# Altium project WaterDispenser.PrjPcb
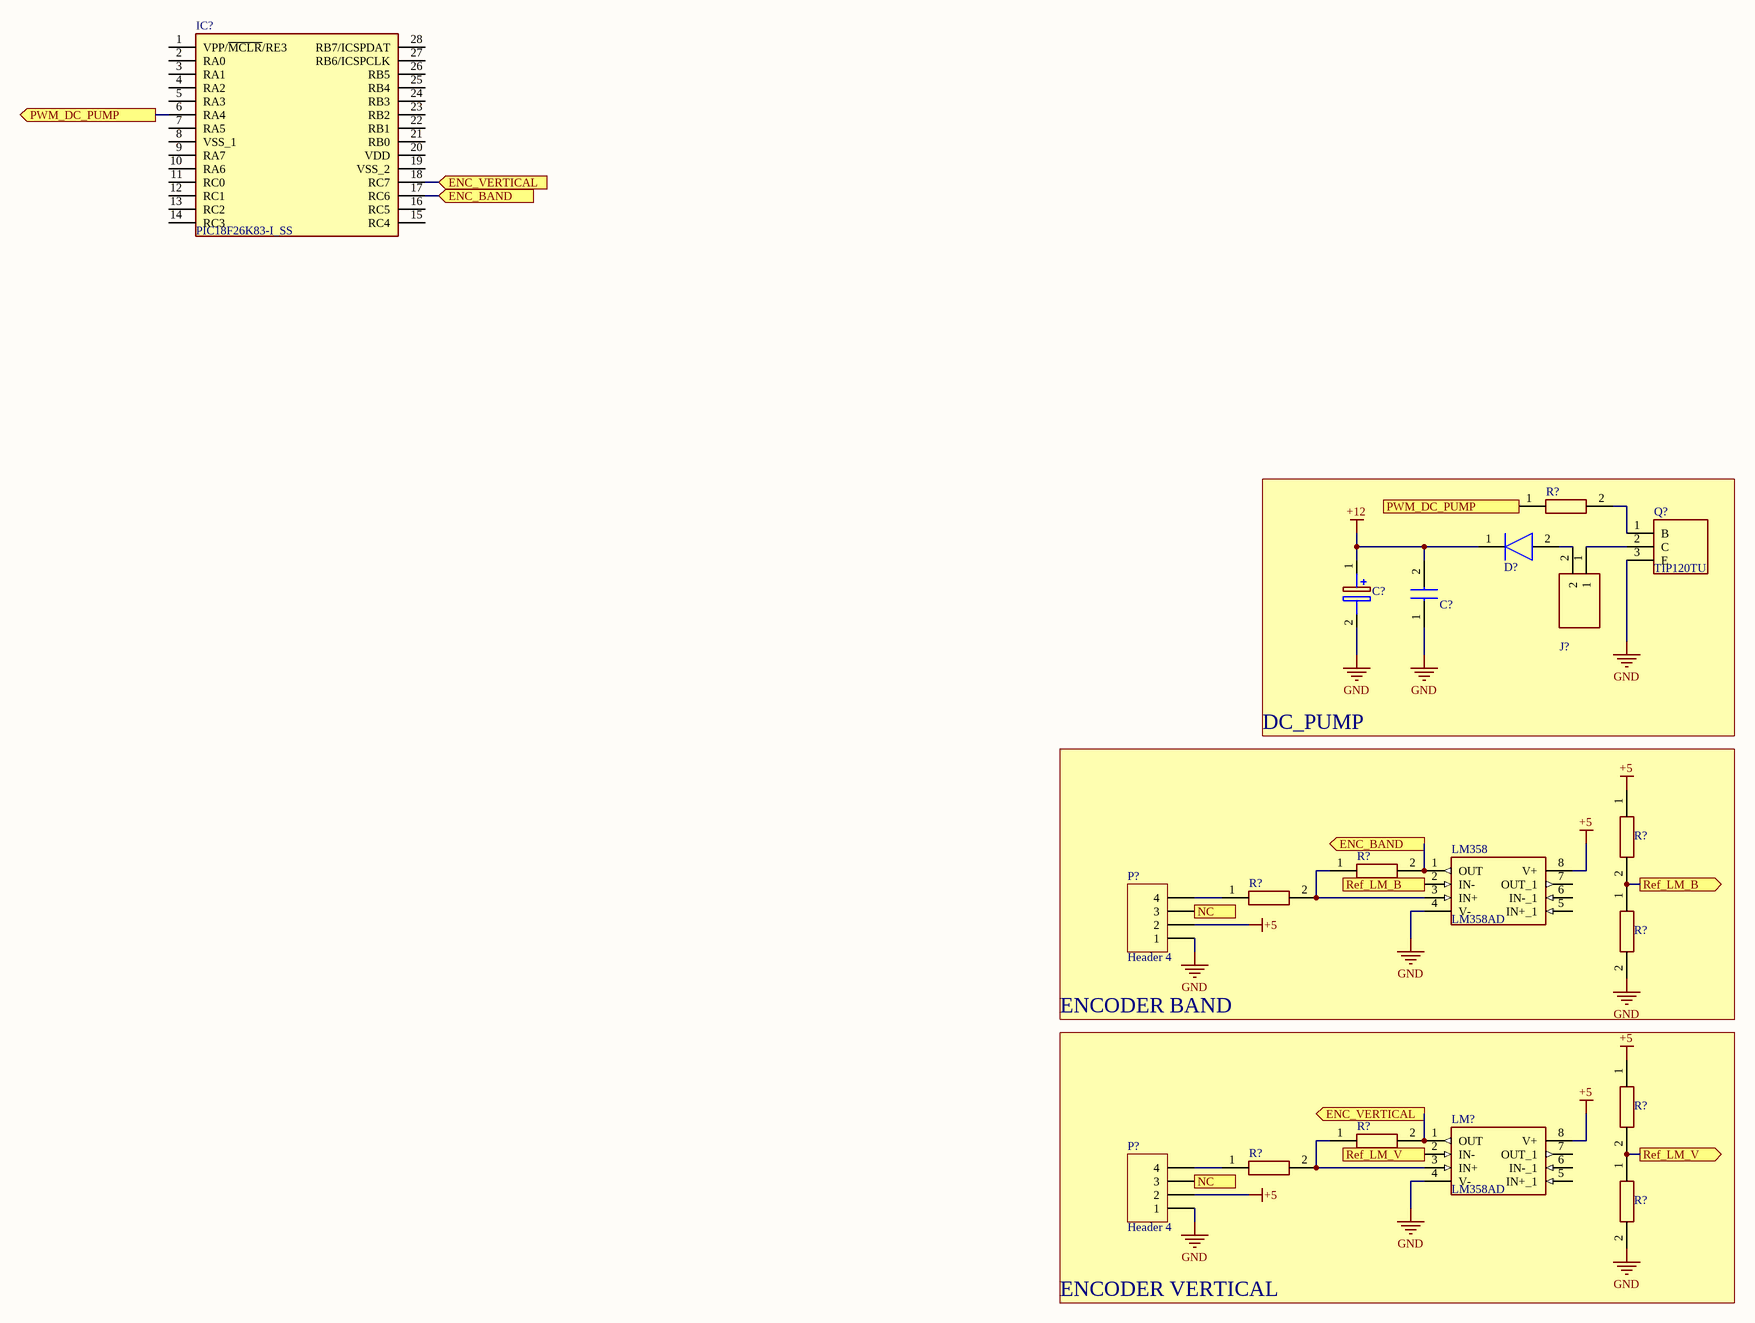
[diagram p0: Sch_WaterDispenser.SchDoc]
1 sheet, 19 parts. Net scope: flat (ports and power ports of the same name join across sheets).

## Sheet Sch_WaterDispenser.SchDoc
size A2; Organization: Altium Limited; Address1: L3, 12a Rodborough Rd; Address2: Frenchs Forest; Address3: NSW; Address4: Australia 2086

### Parts
(Parts that share a designator on the sheet are numbered #1, #2 ... from top to bottom, then left to right.)
C?#1  EEE-HAC221XAP  [CAPAE660X800N]  (value not drawn)
C?#2  GRM2165C1H471JA01J  [CAPC2012X70N]  (value not drawn)
D?  1SR154-400TE25  [DIOM5026X220N]  (value not drawn)
IC?  PIC18F26K83-I_SS  [SOP65P780X200-28N]
J?  TB002-500-02BE  [SHDR2W100P0X500_1X2_1000X760X1040P]  (value not drawn)
LM358  LM358AD  [SOIC127P600X175-8N]
LM?  LM358AD  [SOIC127P600X175-8N]
P?#1  Header 4  [HDR1X4]
P?#2  Header 4  [HDR1X4]
Q?  TIP120TU  [TO254P470X1016X2167-3P]
R?#1  ERJ-6RBD7502V  [RESC2012X70N]  (value not drawn)
R?#2  ERJ-6RBD7502V  [RESC2012X70N]  (value not drawn)
R?#3  ERJ-6RBD7502V  [RESC2012X70N]  (value not drawn)
R?#4  ERJ-6RBD7502V  [RESC2012X70N]  (value not drawn)
R?#5  ERJ-6RBD7502V  [RESC2012X70N]  (value not drawn)
R?#6  ERJ-6RBD7502V  [RESC2012X70N]  (value not drawn)
R?#7  ERJ-6RBD7502V  [RESC2012X70N]  (value not drawn)
R?#8  ERJ-6RBD7502V  [RESC2012X70N]  (value not drawn)
R?#9  ERJ-6RBD7502V  [RESC2012X70N]  (value not drawn)

### Blocks framed on the sheet
DC_PUMP: C?#1 C?#2 D? J? Q? R?#1
ENCODER BAND: LM358 P?#1 R?#2-R?#5
ENCODER VERTICAL: LM? P?#2 R?#6-R?#9

### Ports
ENC_BAND (in), ENC_BAND (out), ENC_VERTICAL (in), ENC_VERTICAL (out), NC, PWM_DC_PUMP (in), PWM_DC_PUMP (out), Ref_LM_B (in), Ref_LM_B (out), Ref_LM_V (in), Ref_LM_V (out)

### Nets
+5: LM358.8(V+) LM?.8(V+) P?#1.2 P?#2.2 R?#2.1 R?#6.1
+12: C?#1.1(+) C?#2.2 D?.1(K)
GND: C?#1.2(-) C?#2.1 LM358.4(V-) LM?.4(V-) P?#1.1 P?#2.1 Q?.3(E) R?#4.2 R?#8.2
NetD?_2: D?.2(A) J?.2
NetIC?_6: IC?.6(RA4) R?#1.1 ; port PWM_DC_PUMP
NetIC?_17: IC?.17(RC6) LM358.1(OUT) R?#3.2 ; port ENC_BAND
NetIC?_18: IC?.18(RC7) LM?.1(OUT) R?#7.2 ; port ENC_VERTICAL
NetJ?_1: J?.1 Q?.2(C)
NetLM358_2: LM358.2(IN-) R?#2.2 R?#4.1 ; port Ref_LM_B
NetLM358_3: LM358.3(IN+) R?#3.1 R?#5.2
NetLM?_2: LM?.2(IN-) R?#6.2 R?#8.1 ; port Ref_LM_V
NetLM?_3: LM?.3(IN+) R?#7.1 R?#9.2
NetP?#1_3: P?#1.3 P?#2.3 ; port NC
NetP?#1_4: P?#1.4 R?#5.1
NetP?#2_4: P?#2.4 R?#9.1
NetQ?_1: Q?.1(B) R?#1.2

Not connected (* = marked no-connect by the designer): IC? 1(VPP/~{MCLR}/RE3) 2(RA0) 3(RA1) 4(RA2) 5(RA3) 7(RA5) 8(VSS_1) 9(RA7) 10(RA6) 11(RC0) 12(RC1) 13(RC2) 14(RC3) 15(RC4) 16(RC5) 19(VSS_2) 20(VDD) 21(RB0) 22(RB1) 23(RB2) 24(RB3) 25(RB4) 26(RB5) 27(RB6/ICSPCLK) 28(RB7/ICSPDAT); LM358 5(IN+_1) 6(IN-_1) 7(OUT_1); LM? 5(IN+_1) 6(IN-_1) 7(OUT_1)

### Notes on the sheet
- Title
- Size:
- Date:
- File:
- A2
- Number:
- Time:
- Revision:
- Sheet
- of

### Library data of the parts
C?#1 = EEE-HAC221XAP: Capacitor Polarised; Manufacturer_Name: Panasonic; Allied_Number: 70258490; Datasheet Link: https://industrial.panasonic.com/cdbs/www-data/pdf/RDE0000/ABA0000C1148.pdf; Height: 8mm; Manufacturer_Part_Number: EEE-HAC221XAP; Mouser Part Number: 667-EEE-HAC221XAP; Mouser Price/Stock: https://www.mouser.com/Search/Refine.aspx?Keyword=667-EEE-HAC221XAP; Allied Price/Stock: https://www.alliedelec.com/panasonic-eee-hac221xap/70258490/
C?#2 = GRM2165C1H471JA01J: Capacitor; Manufacturer_Name: Murata Electronics; Datasheet Link: http://www.murata.com/~/media/webrenewal/support/library/catalog/products/capacitor/mlcc/c02e.pdf; Height: 0.7mm; Manufacturer_Part_Number: GRM2165C1H471JA01J; Mouser Part Number: 81-GRM215C1H471JA01J; Mouser Price/Stock: https://www.mouser.com/Search/Refine.aspx?Keyword=81-GRM215C1H471JA01J
D? = 1SR154-400TE25: Diode; Manufacturer_Name: ROHM Semiconductor; Allied_Number: 70521917; Datasheet Link: http://www.rohm.com/web/global/datasheet/1SR154-400; Height: 2.2mm; Manufacturer_Part_Number: 1SR154-400TE25; Mouser Part Number: 755-1SR154-400TE25; Mouser Price/Stock: https://www.mouser.com/Search/Refine.aspx?Keyword=755-1SR154-400TE25; RS Part Number: 7002808P; RS Price/Stock: http://uk.rs-online.com/web/p/products/7002808P; Allied Price/Stock: https://www.alliedelec.com/rohm-semiconductor-1sr154-400te25/70521917/
IC? = PIC18F26K83-I_SS: Integrated Circuit; Manufacturer_Name: Microchip; Manufacturer_Part_Number: PIC18F26K83-I/SS; Datasheet Link: https://componentsearchengine.com/Datasheets/1/PIC18F26K83-I_SS.pdf; Height: 2mm; Mouser Part Number: 579-PIC18F26K83-I/SS; Mouser Price/Stock: https://www.mouser.com/Search/Refine.aspx?Keyword=579-PIC18F26K83-I%2FSS
J? = TB002-500-02BE: Connector; Manufacturer_Name: CUI Devices; Datasheet Link: https://componentsearchengine.com/Datasheets/1/TB002-500-02BE.pdf; Height: 10.4mm; Manufacturer_Part_Number: TB002-500-02BE; Mouser Part Number: 490-TB002-500-02BE; Mouser Price/Stock: https://www.mouser.com/Search/Refine.aspx?Keyword=490-TB002-500-02BE
LM358 LM? = LM358AD: Integrated Circuit; Manufacturer_Name: STMicroelectronics; Datasheet Link: http://www.st.com/st-web-ui/static/active/en/resource/technical/document/datasheet/CD00000464.pdf; Height: 1.75mm; Manufacturer_Part_Number: LM358AD; Mouser Part Number: 511-LM358AD; Mouser Price/Stock: https://www.mouser.com/Search/Refine.aspx?Keyword=511-LM358AD; RS Part Number: 7147415P; RS Price/Stock: http://uk.rs-online.com/web/p/products/7147415P
P?#1 P?#2 = Header 4: Header, 4-Pin; LatestRevisionDate: 17-Jul-2002; LatestRevisionNote: Re-released for DXP Platform.; Publisher: Altium Limited
Q? = TIP120TU: Transistor; Manufacturer_Name: ON Semiconductor; Datasheet Link: https://www.mouser.com/datasheet/2/308/TIP120-1125433.pdf; Height: 4.7mm; Manufacturer_Part_Number: TIP120TU; Mouser Part Number: 512-TIP120TU; Mouser Price/Stock: https://www.mouser.com/Search/Refine.aspx?Keyword=512-TIP120TU; RS Part Number: 8080502P; RS Price/Stock: http://uk.rs-online.com/web/p/products/8080502P
R?#1-R?#9 = ERJ-6RBD7502V: Resistor; Manufacturer_Name: Panasonic; Datasheet Link: http://docs-emea.rs-online.com/webdocs/13ba/0900766b813ba21b.pdf; Height: 0.7mm; Manufacturer_Part_Number: ERJ-6RBD7502V; Mouser Part Number: 667-ERJ-6RBD7502V; Mouser Price/Stock: https://www.mouser.com/Search/Refine.aspx?Keyword=667-ERJ-6RBD7502V